# Altium schematic sheet MainConnector.SchDoc
size A4
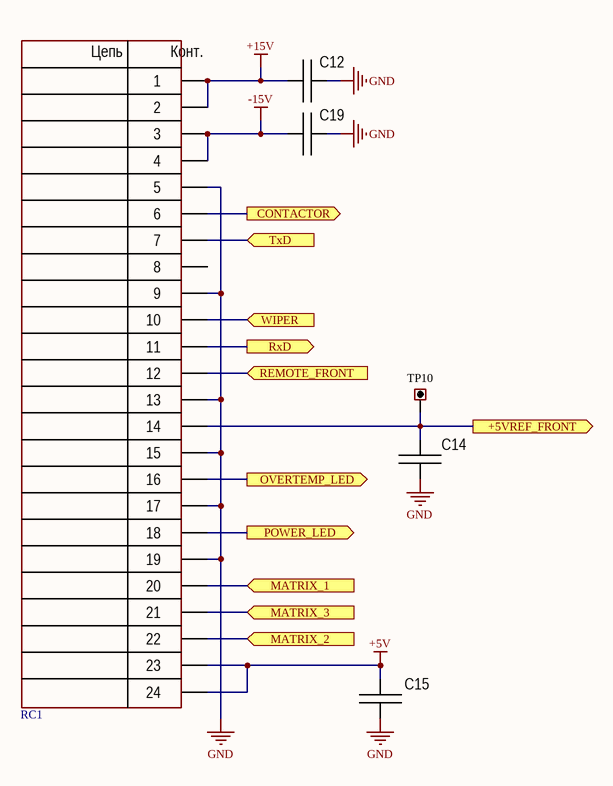
[diagram p0: MainConnector.SchDoc]

## Parts
C12  (no value)  [CAP: 1206]
C14  (no value)  [CAP: 1206]
C15  (no value)  [CAP: 1206]
C19  (no value)  [CAP: 1206]
RC1  (no value)  [DS1018-24 SIBX]
TP10  Test_Point  [Test_Point]  (value not drawn)  (no BOM)

## Ports
+5VREF_FRONT (out), CONTACTOR (out), MATRIX_1 (in), MATRIX_2 (in), MATRIX_3 (in), OVERTEMP_LED (out), POWER_LED (out), REMOTE_FRONT (in), RxD (out), TxD (in), WIPER (in)

## Nets
+5V: C15.2 RC1.23 RC1.24
+15V: C12.2 RC1.1 RC1.2
-15V: C19.1 RC1.3 RC1.4
GND: C12.1 C14.1 C15.1 C19.2 RC1.5 RC1.9 RC1.13 RC1.15 RC1.17 RC1.19
+5VREF_FRONT: C14.2 RC1.14 TP10.1 ; port +5VREF_FRONT
CONTACTOR: RC1.6 ; port CONTACTOR
MATRIX_1: RC1.20 ; port MATRIX_1
MATRIX_2: RC1.22 ; port MATRIX_2
MATRIX_3: RC1.21 ; port MATRIX_3
OVERTEMP_LED: RC1.16 ; port OVERTEMP_LED
POWER_LED: RC1.18 ; port POWER_LED
REMOTE_FRONT: RC1.12 ; port REMOTE_FRONT
RxD: RC1.11 ; port RxD
TxD: RC1.7 ; port TxD
WIPER: RC1.10 ; port WIPER

Not connected (* = marked no-connect by the designer): RC1 8

## Notes on the sheet
- (in symbol DS1018-24 SIBX) Цепь; Конт.

## Library data of the parts
C12 C14 C15 C19 = Ceramic_1206: Manufacturer: Yageo; PartNumber: CC1206KRX7R9BB104; ValueManufacturerPartNumber: Ceramic capacitor, 0.1μF, 1206; TypeCapacitor: Ceramic capacitor; Tolerance: ±10%; TypeDielectric: X7R; Voltage: 50V; Value: 0.1μF; Package: 1206; HelpURL: https://www.digikey.com/product-detail/en/yageo/CC1206KRX7R9BB104/311-1179-1-ND/303089; Temperature: -55...+125°C
RC1 = DS1018-24 SIBX: ValueManufacturerPartNumber: Connector, DS1018-24 SIBX, 24 pin; Multichannel: 24 pin; TypeConnector: Connector; PartNumber: DS1018-24 SIBX